# EAGLE schematic Motor Control Hat Schematic (EAGLE 9.6.2)

## Sheet 1 of 2
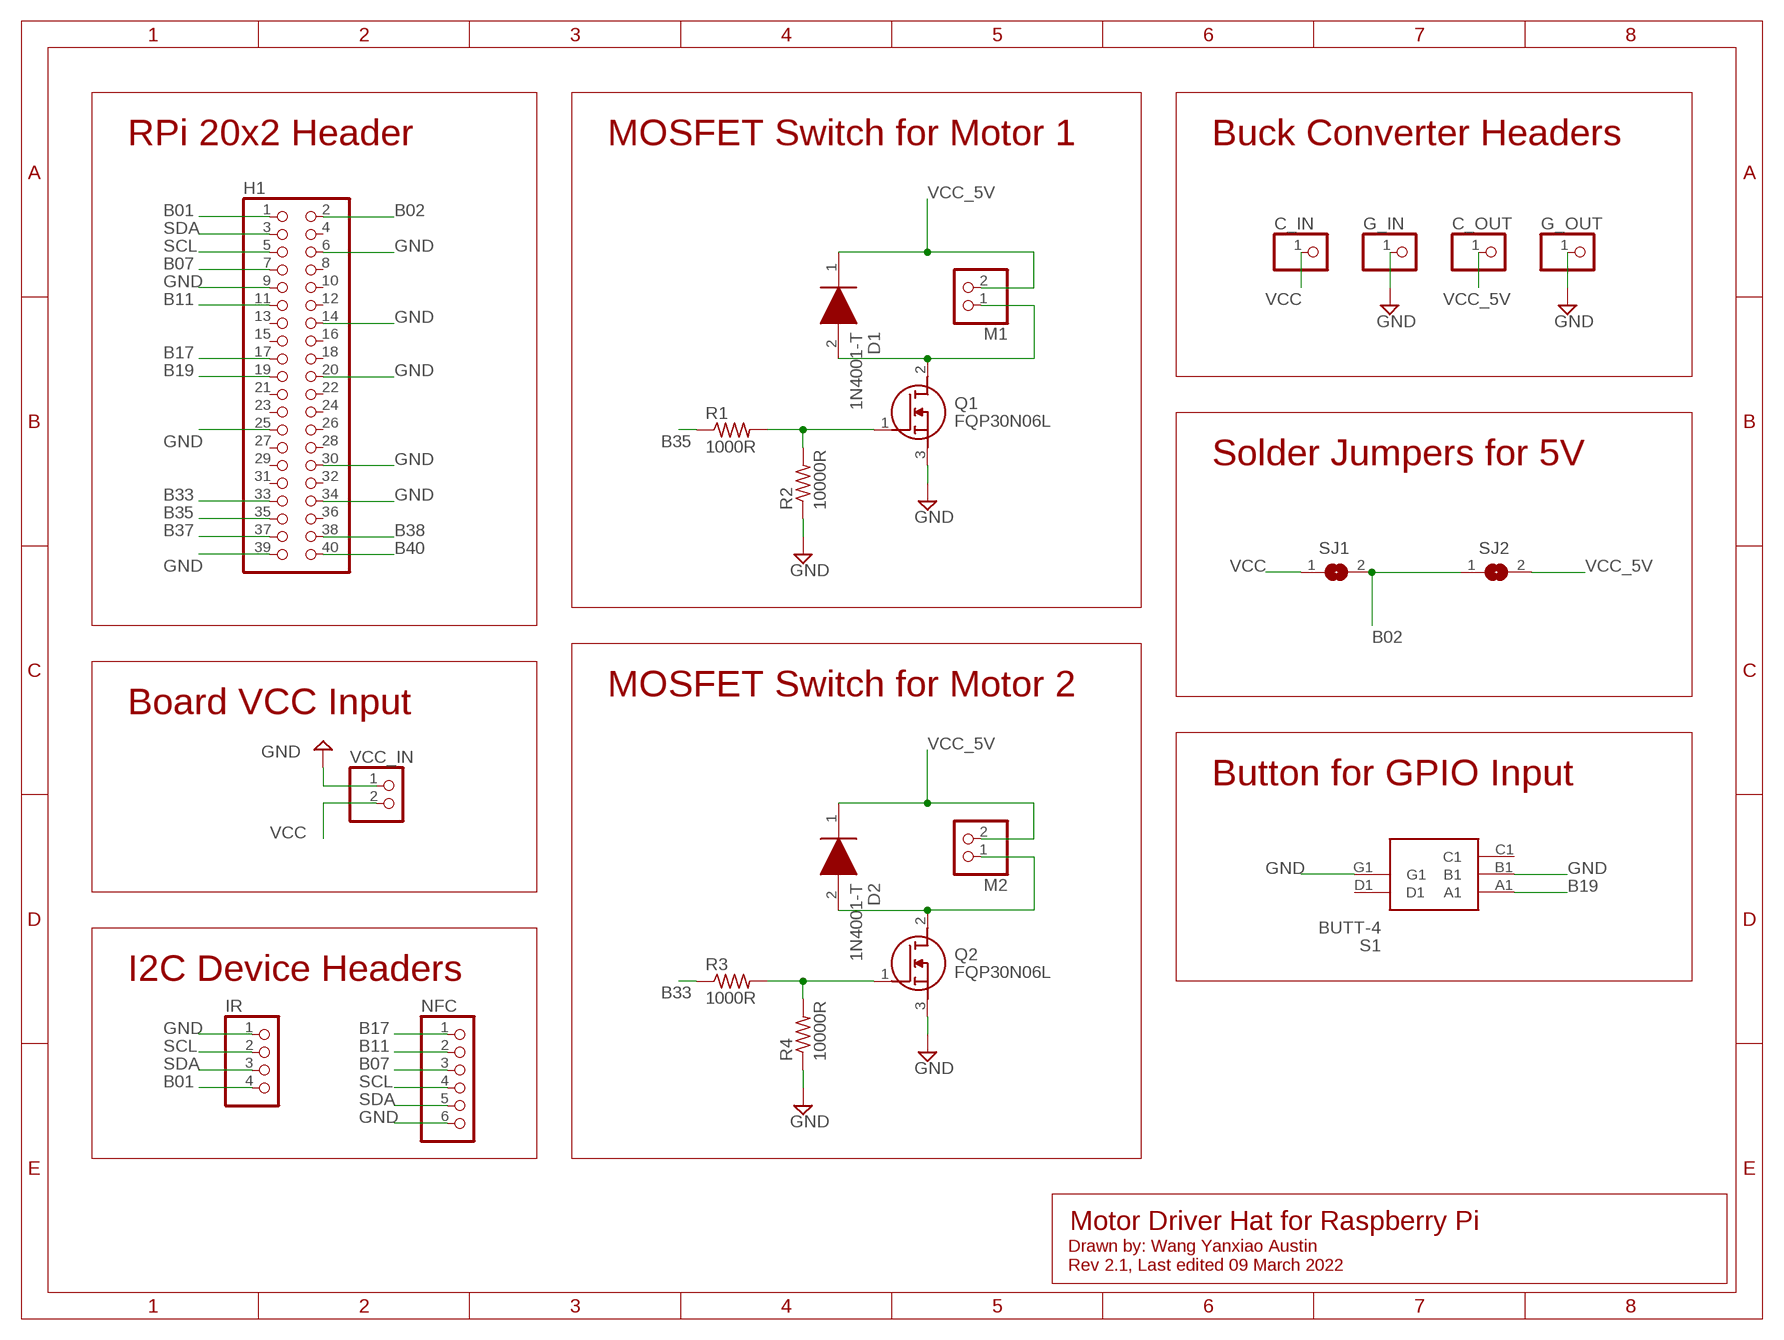
[diagram p0: schematic, sheet 1]

### Parts
C_IN  PINHD-1X1  [1X01]
C_OUT  PINHD-1X1  [1X01]
D1  1N4001-T  [DIOAD1408W86L464D236]
D2  1N4001-T  [DIOAD1408W86L464D236]
G_IN  PINHD-1X1  [1X01]
G_OUT  PINHD-1X1  [1X01]
H1  PINHD-2X20  [2X20]
IR  PINHD-1X4  [1X04]
M1  PINHD-1X2  [1X02]
M2  PINHD-1X2  [1X02]
NFC  PINHD-1X6  [1X06]
Q1  FQP30N06L  [TO254P470X1016X2019-3P]
Q2  FQP30N06L  [TO254P470X1016X2019-3P]
R1  1000R  R-US_0207/10  [0207/10]
R2  10000R  R-US_0207/10  [0207/10]
R3  1000R  R-US_0207/10  [0207/10]
R4  10000R  R-US_0207/10  [0207/10]
S1  BUTT-4  [BUTT4]
SJ1  SJ  [SJ]
SJ2  SJ  [SJ]
VCC_IN  PINHD-1X2  [1X02]

### Nets
B01: H1.1 IR.4
B02: H1.2 SJ1.2 SJ2.1
B07: H1.7 NFC.3
B11: H1.11 NFC.2
B17: H1.17 NFC.1
B19: H1.19 S1.A1
B33: H1.33 R3.1
B35: H1.35 R1.1
B37: H1.37
B38: H1.38
B40: H1.40
GND: G_IN.1 G_OUT.1 H1.6 H1.9 H1.14 H1.20 H1.25 H1.30 H1.34 H1.39 IR.1 NFC.6 Q1.3(S) Q2.3(S) R2.1 R4.1 S1.B1 S1.G1 VCC_IN.1
N$1: Q1.1(G) R1.2 R2.2
N$2: D1.2(A) M1.1 Q1.2(D)
N$3: Q2.1(G) R3.2 R4.2
N$4: D2.2(A) M2.1 Q2.2(D)
SCL: H1.5 IR.2 NFC.4
SDA: H1.3 IR.3 NFC.5
VCC: C_IN.1 SJ1.1 VCC_IN.2
VCC_5V: C_OUT.1 D1.1(K) D2.1(K) M1.2 M2.2 SJ2.2
Unconnected: H1.4 H1.8 H1.10 H1.12 H1.13 H1.15 H1.16 H1.18 H1.21 H1.22 H1.23 H1.24 H1.26 H1.27 H1.28 H1.29 H1.31 H1.32 H1.36 S1.C1 S1.D1

### Notes on the sheet
- RPi 20x2 Header | MOSFET Switch for Motor 1 | Buck Converter Headers
- Solder Jumpers for 5V
- MOSFET Switch for Motor 2
- Board VCC Input
- Button for GPIO Input
- I2C Device Headers
- Motor Driver Hat for Raspberry Pi
- Drawn by: Wang Yanxiao Austin
  Rev 2.1, Last edited 09 March 2022

## Sheet 2 of 2
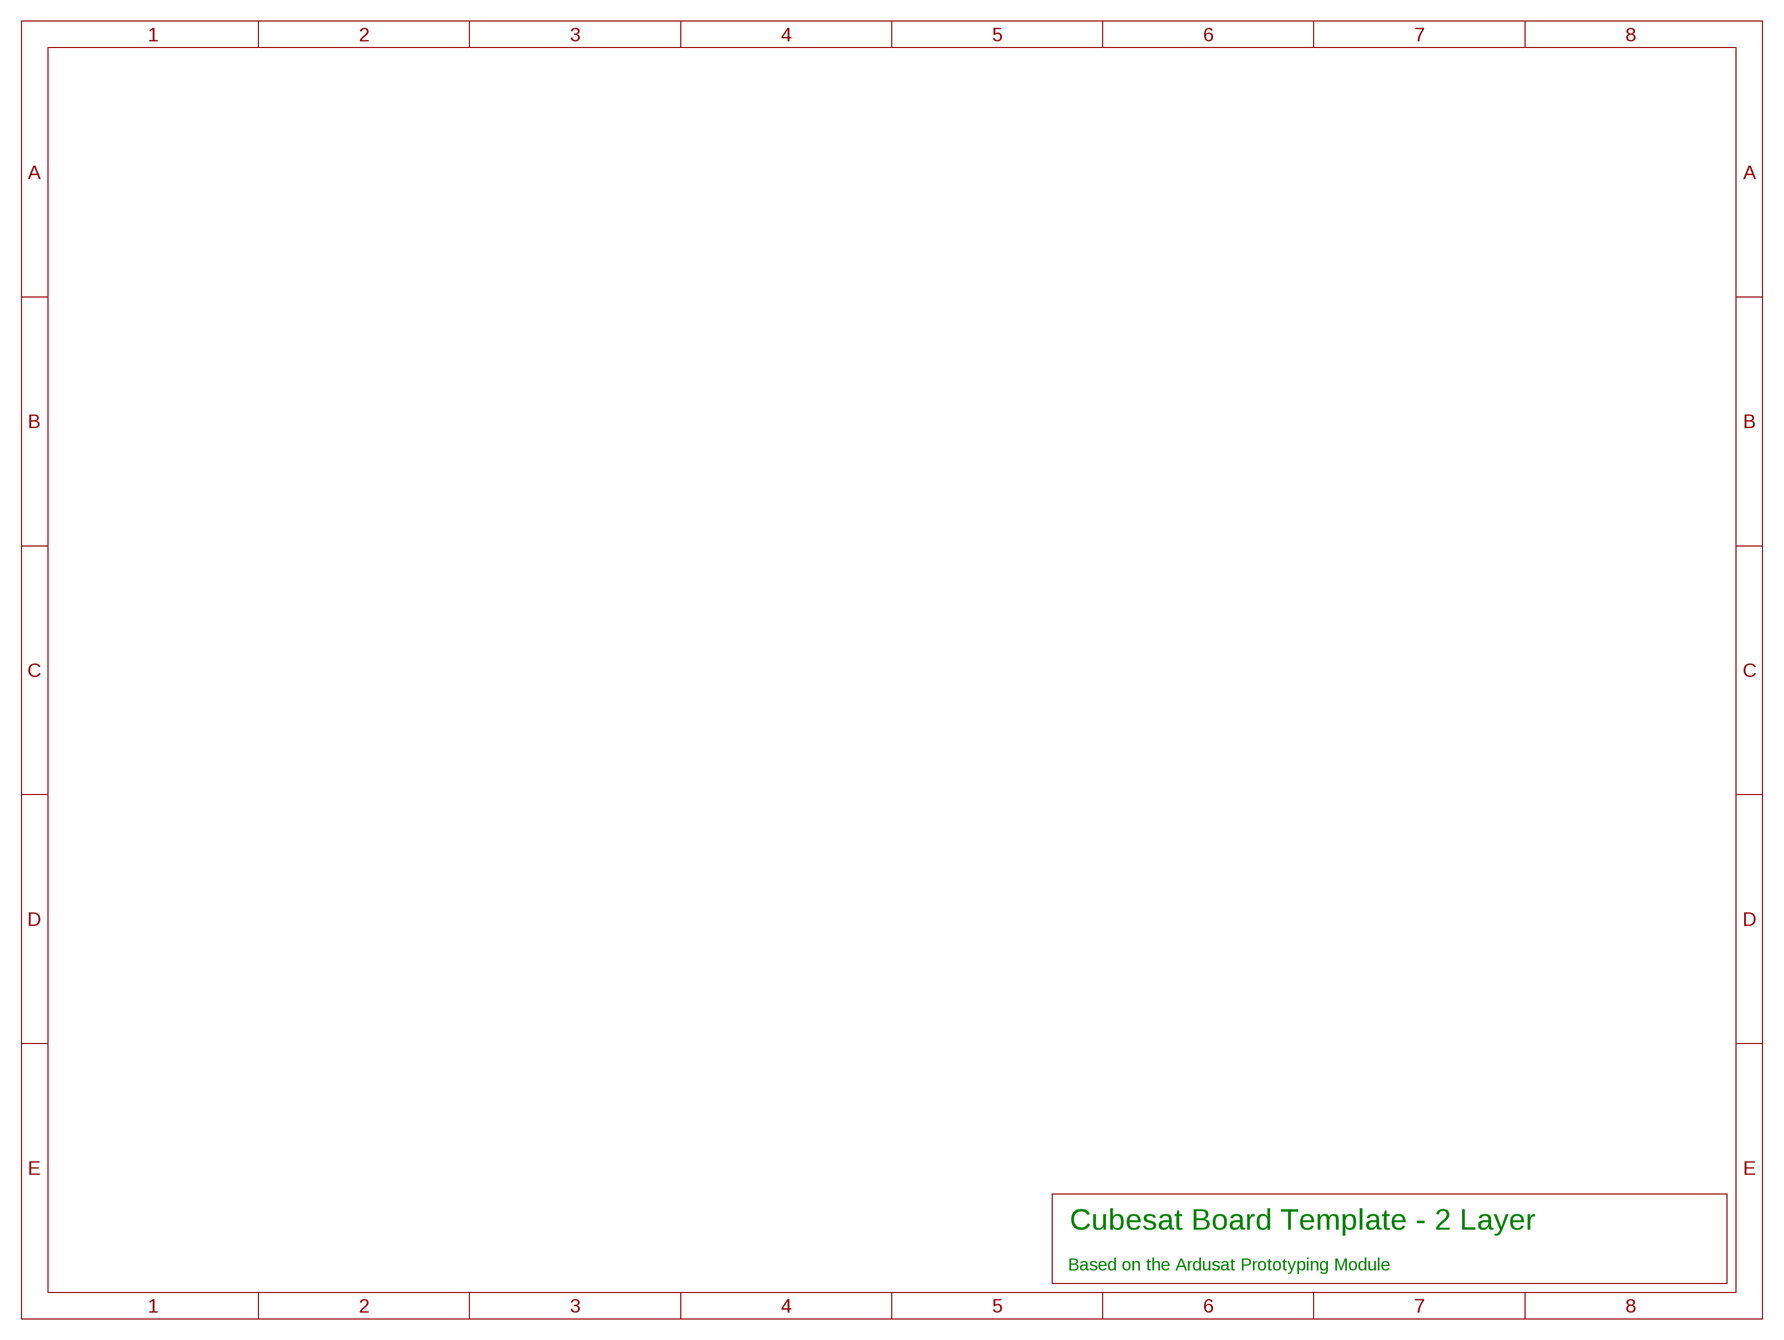
[diagram p1: schematic, sheet 2]

### Notes on the sheet
- Cubesat Board Template - 2 Layer
- Based on the Ardusat Prototyping Module

## Library data of the parts
C_IN C_OUT G_IN G_OUT = pinhead:PINHD-1X1: PIN HEADER
D1 D2 = SamacSys_Parts:1N4001-T: Diode Switching 50V 1A 2Pin DO41 Diodes Inc 1N4001-T Switching Diode, 1A 50V, 2-Pin DO-41 Source: Datasheet <https://datasheet.datasheetarchive.com/originals/distributors/Datasheets-9/DSA-163121.pdf>; ARROW_PART_NUMBER: 1N4001-T; ARROW_PRICE-STOCK: https://www.arrow.com/en/products/1n4001-t/diodes-incorporated?region=nac; DESCRIPTION: Diode Switching 50V 1A 2Pin DO41 Diodes Inc 1N4001-T Switching Diode, 1A 50V, 2-Pin DO-41; HEIGHT: mm; MANUFACTURER_NAME: Diodes Inc.; MANUFACTURER_PART_NUMBER: 1N4001-T; MOUSER_PART_NUMBER: 621-1N4001; MOUSER_PRICE-STOCK: https://www.mouser.co.uk/ProductDetail/Diodes-Incorporated/1N4001-T?qs=e%2FRqmsgwm9i%2FVrrtazegeg%3D%3D
H1 = pinhead:PINHD-2X20: PIN HEADER; SPICEPREFIX: X
IR = pinhead:PINHD-1X4: PIN HEADER
M1 M2 VCC_IN = pinhead:PINHD-1X2: PIN HEADER
NFC = pinhead:PINHD-1X6: PIN HEADER
Q1 Q2 = SamacSys_Parts:FQP30N06L: FQP30N06L N-Channel MOSFET, 32 A, 60 V QFET, 3-Pin TO-220 ON Semiconductor Source: Datasheet <https://www.mouser.com/datasheet/2/308/FQP30N06L-1306227.pdf>; ARROW_PART_NUMBER: FQP30N06L; ARROW_PRICE-STOCK: https://www.arrow.com/en/products/fqp30n06l/on-semiconductor?region=nac; DESCRIPTION: FQP30N06L N-Channel MOSFET, 32 A, 60 V QFET, 3-Pin TO-220 ON Semiconductor; HEIGHT: 4.7mm; MANUFACTURER_NAME: ON Semiconductor; MANUFACTURER_PART_NUMBER: FQP30N06L; MOUSER_PART_NUMBER: 512-FQP30N06L; MOUSER_PRICE-STOCK: https://www.mouser.co.uk/ProductDetail/ON-Semiconductor-Fairchild/FQP30N06L?qs=%252Beu4QTTVkDqugBwFplJ%252Bug%3D%3D
R1-R4 = rcl:R-US_: RESISTOR, American symbol; SPICEPREFIX: R
S1 = SamacSys_Parts:BUTT-4: Tactile Switches MINI PUSH BUTTON SWITCH 4-PIN QTY. 4 Source: Datasheet <http://site.gravitech.us/Components/BUTT-4/BUTT-4_datasheet.pdf>; DESCRIPTION: Tactile Switches MINI PUSH BUTTON SWITCH 4-PIN QTY. 4; HEIGHT: 9.5mm; MANUFACTURER_NAME: Gravitech; MANUFACTURER_PART_NUMBER: BUTT-4; MOUSER_PART_NUMBER: 992-BUTT-4; MOUSER_PRICE-STOCK: https://www.mouser.co.uk/ProductDetail/Gravitech/BUTT-4?qs=Vxac6xGyzPm51iLpy8GNew%3D%3D
SJ1 SJ2 = jumper:SJ: SMD solder JUMPER

## Net classes
1 USB: width 0.203 mm, drill 0.406 mm, clearance 0.203 mm
3 usbvcc: width 0.203 mm, drill 0.406 mm, clearance 0.203 mm
4 USBpair: width 0.254 mm, drill 0.406 mm, clearance 0.61 mm